# Altium schematic sheet sensor.SchDoc
size A3; SheetNumber: 1; SheetTotal: 2
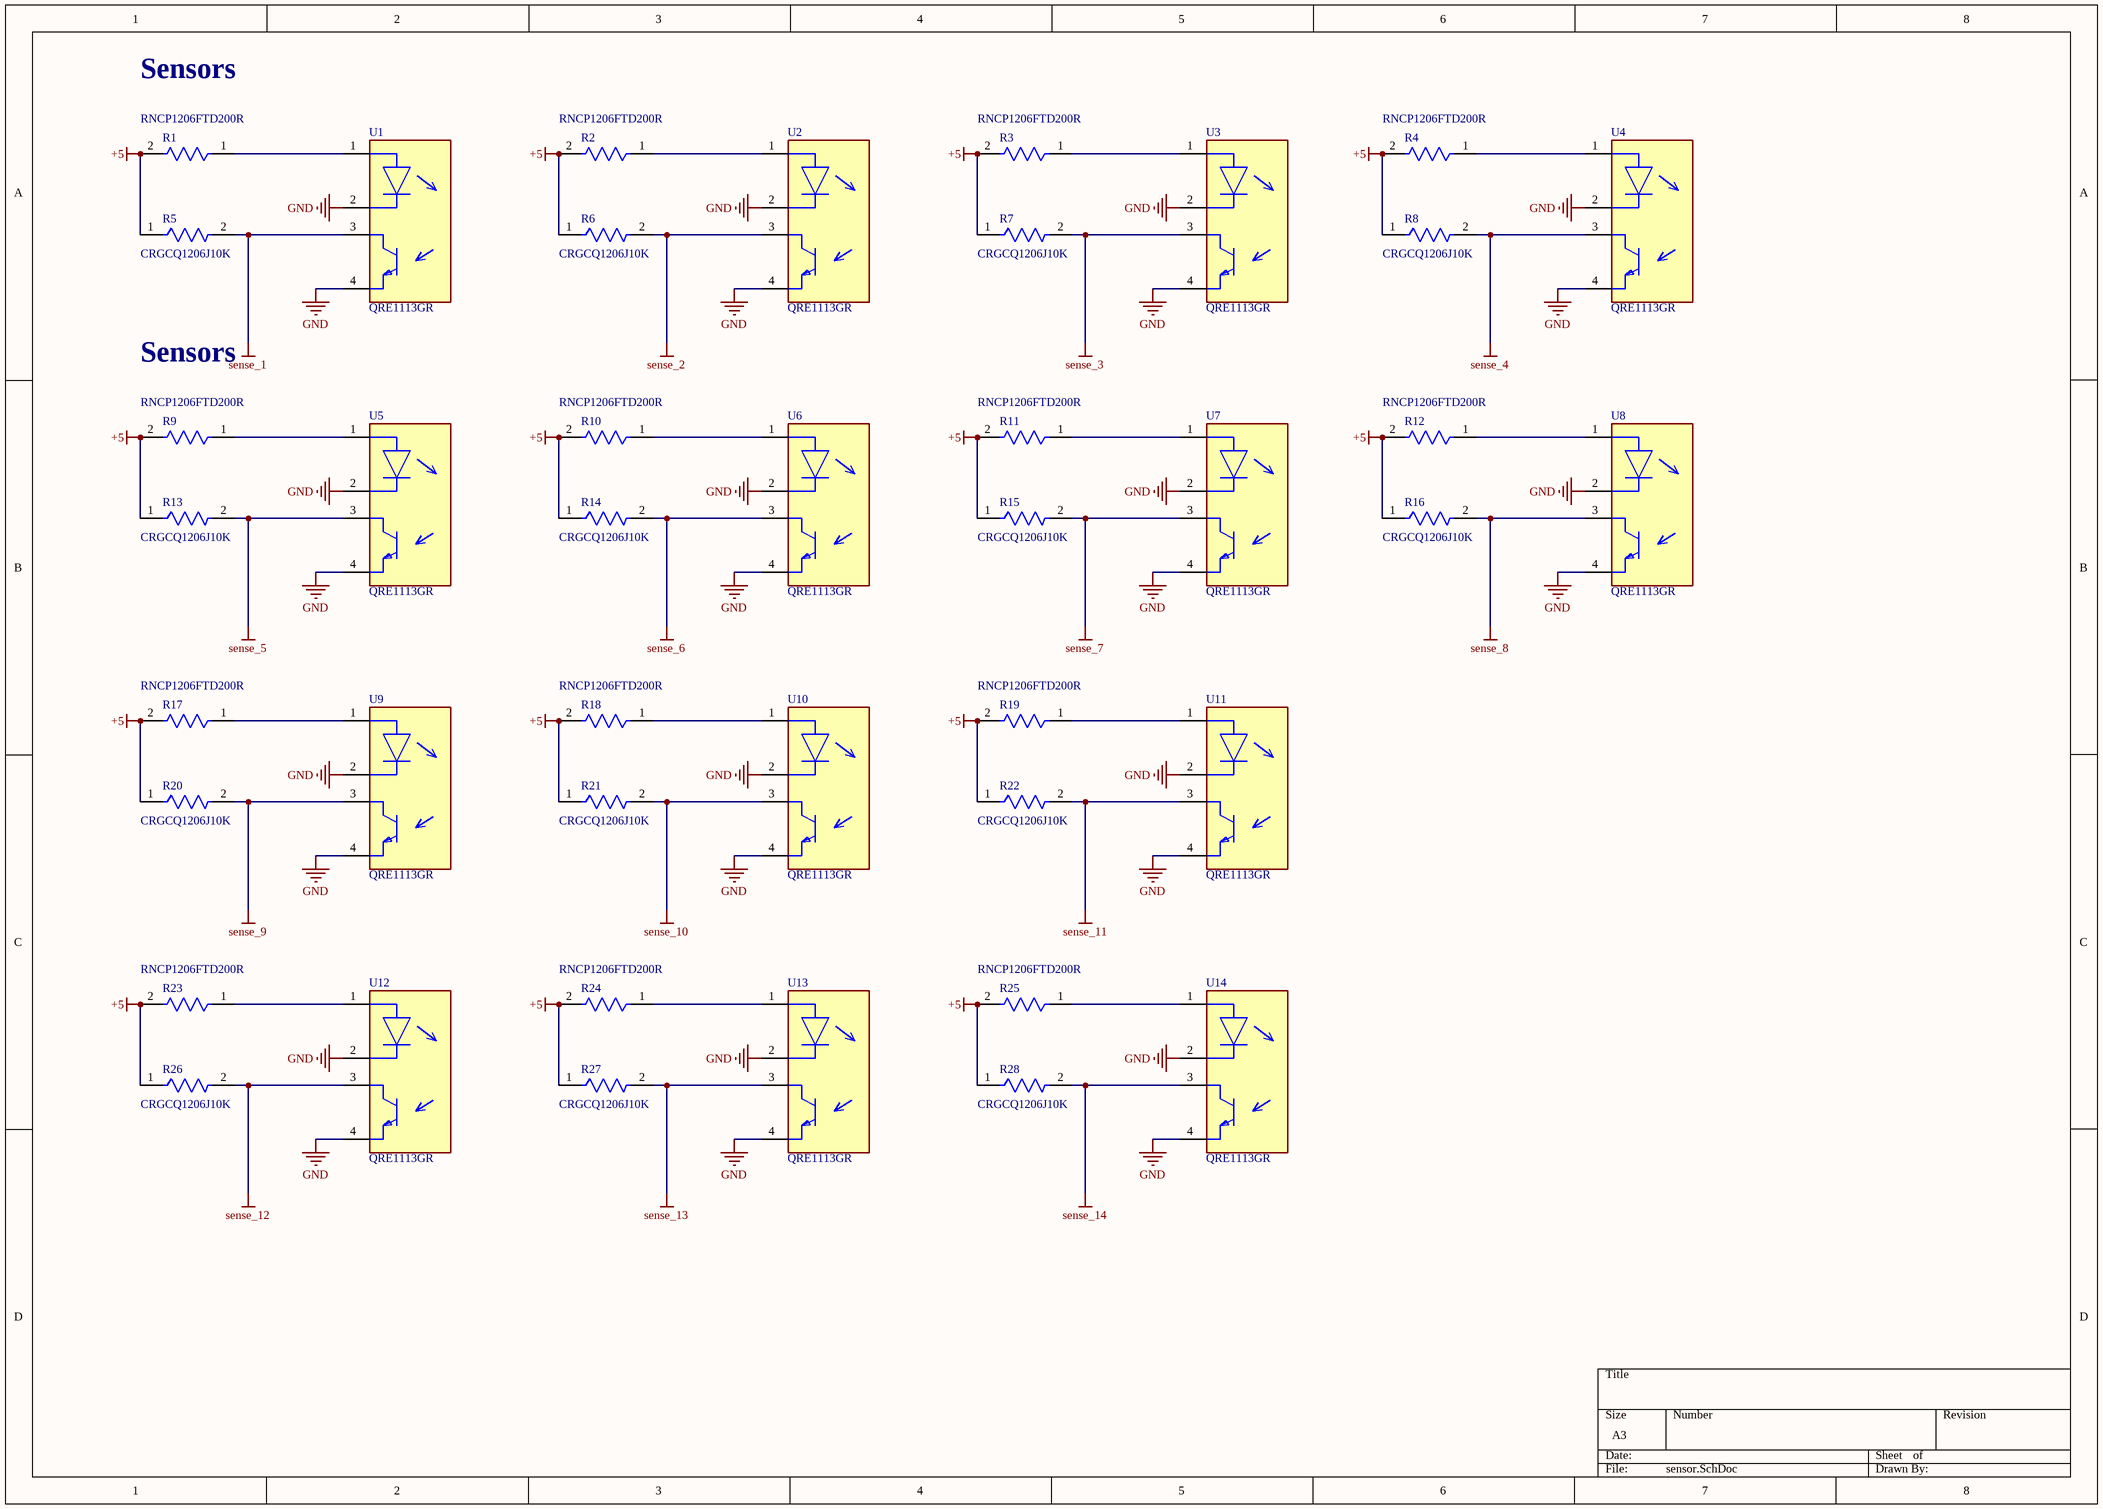
[diagram p0: sensor.SchDoc]

## Parts
R1  RNCP1206FTD200R  [FP-RNCP1206-IPC_B]
R2  RNCP1206FTD200R  [FP-RNCP1206-IPC_B]
R3  RNCP1206FTD200R  [FP-RNCP1206-IPC_B]
R4  RNCP1206FTD200R  [FP-RNCP1206-IPC_B]
R5  CRGCQ1206J10K  [FP-CRGCQ1206-IPC_C]
R6  CRGCQ1206J10K  [FP-CRGCQ1206-IPC_C]
R7  CRGCQ1206J10K  [FP-CRGCQ1206-IPC_C]
R8  CRGCQ1206J10K  [FP-CRGCQ1206-IPC_C]
R9  RNCP1206FTD200R  [FP-RNCP1206-IPC_B]
R10  RNCP1206FTD200R  [FP-RNCP1206-IPC_B]
R11  RNCP1206FTD200R  [FP-RNCP1206-IPC_B]
R12  RNCP1206FTD200R  [FP-RNCP1206-IPC_B]
R13  CRGCQ1206J10K  [FP-CRGCQ1206-IPC_C]
R14  CRGCQ1206J10K  [FP-CRGCQ1206-IPC_C]
R15  CRGCQ1206J10K  [FP-CRGCQ1206-IPC_C]
R16  CRGCQ1206J10K  [FP-CRGCQ1206-IPC_C]
R17  RNCP1206FTD200R  [FP-RNCP1206-IPC_B]
R18  RNCP1206FTD200R  [FP-RNCP1206-IPC_B]
R19  RNCP1206FTD200R  [FP-RNCP1206-IPC_B]
R20  CRGCQ1206J10K  [FP-CRGCQ1206-IPC_C]
R21  CRGCQ1206J10K  [FP-CRGCQ1206-IPC_C]
R22  CRGCQ1206J10K  [FP-CRGCQ1206-IPC_C]
R23  RNCP1206FTD200R  [FP-RNCP1206-IPC_B]
R24  RNCP1206FTD200R  [FP-RNCP1206-IPC_B]
R25  RNCP1206FTD200R  [FP-RNCP1206-IPC_B]
R26  CRGCQ1206J10K  [FP-CRGCQ1206-IPC_C]
R27  CRGCQ1206J10K  [FP-CRGCQ1206-IPC_C]
R28  CRGCQ1206J10K  [FP-CRGCQ1206-IPC_C]
U1  QRE1113GR  [FP-100CY-MFG]
U2  QRE1113GR  [FP-100CY-MFG]
U3  QRE1113GR  [FP-100CY-MFG]
U4  QRE1113GR  [FP-100CY-MFG]
U5  QRE1113GR  [FP-100CY-MFG]
U6  QRE1113GR  [FP-100CY-MFG]
U7  QRE1113GR  [FP-100CY-MFG]
U8  QRE1113GR  [FP-100CY-MFG]
U9  QRE1113GR  [FP-100CY-MFG]
U10  QRE1113GR  [FP-100CY-MFG]
U11  QRE1113GR  [FP-100CY-MFG]
U12  QRE1113GR  [FP-100CY-MFG]
U13  QRE1113GR  [FP-100CY-MFG]
U14  QRE1113GR  [FP-100CY-MFG]

## Nets
+5: R1.2 R2.2 R3.2 R4.2 R5.1 R6.1 R7.1 R8.1 R9.2 R10.2 R11.2 R12.2 R13.1 R14.1 R15.1 R16.1 R17.2 R18.2 R19.2 R20.1 R21.1 R22.1 R23.2 R24.2 R25.2 R26.1 R27.1 R28.1
GND: U1.2(C) U1.4(E) U2.2(C) U2.4(E) U3.2(C) U3.4(E) U4.2(C) U4.4(E) U5.2(C) U5.4(E) U6.2(C) U6.4(E) U7.2(C) U7.4(E) U8.2(C) U8.4(E) U9.2(C) U9.4(E) U10.2(C) U10.4(E) U11.2(C) U11.4(E) U12.2(C) U12.4(E) U13.2(C) U13.4(E) U14.2(C) U14.4(E)
sense_1: R5.2 U1.3(C)
sense_2: R6.2 U2.3(C)
sense_3: R7.2 U3.3(C)
sense_4: R8.2 U4.3(C)
sense_5: R13.2 U5.3(C)
sense_6: R14.2 U6.3(C)
sense_7: R15.2 U7.3(C)
sense_8: R16.2 U8.3(C)
sense_9: R20.2 U9.3(C)
sense_10: R21.2 U10.3(C)
sense_11: R22.2 U11.3(C)
sense_12: R26.2 U12.3(C)
sense_13: R27.2 U13.3(C)
sense_14: R28.2 U14.3(C)
NetR1_1: R1.1 U1.1(A)
NetR2_1: R2.1 U2.1(A)
NetR3_1: R3.1 U3.1(A)
NetR4_1: R4.1 U4.1(A)
NetR9_1: R9.1 U5.1(A)
NetR10_1: R10.1 U6.1(A)
NetR11_1: R11.1 U7.1(A)
NetR12_1: R12.1 U8.1(A)
NetR17_1: R17.1 U9.1(A)
NetR18_1: R18.1 U10.1(A)
NetR19_1: R19.1 U11.1(A)
NetR23_1: R23.1 U12.1(A)
NetR24_1: R24.1 U13.1(A)
NetR25_1: R25.1 U14.1(A)

## Notes on the sheet
- Sensors

## Library data of the parts
R1-R4 R9-R12 R17-R19 R23-R25 = CMP-26527-001516-1: 200Ω ±1% 0.5W 1206 High Power Anti-Sulfur Thin Film Chip Resistor; Temperature Coefficient: 100ppm/°C; Resistance: 200R; Max Power Dissipation: 500mW; Series: RNCP; Max Operating Temperature: 155°C; Min Operating Temperature: -55°C; Mount: Surface Mount; RoHS Compliant: Yes; Tolerance: 1%; Height: 0.024inch; Resistor Type: Thin Film; Packaging: Tape and Reel; Case Code (Imperial): 1206; Case/Package: 1206; Lead Free: Lead Free; Width: 0.059inch; Number of Terminations: 2; Case Code (Metric): 3216; Length: 0.122inch; Features: Moisture Resistant
R5-R8 R13-R16 R20-R22 R26-R28 = CMP-03211-002305-1: CRGCQ1206 10KΩ 0.25W 5% ±100ppm/°C 200V; Manufacturer: TE Connectivity; Automotive Grade: Grade 914; Tolerance: 0.05; Package: CRGCQ1206; Composition: Thick Film; Lead Free: Yes; Device Class L1: Passive Components; RoHS: TRUE; Temperature: -55°C to +155°C; Series: CRGCQ; Temperature Range Low: -55°C; Ipc Land Pattern Name: RESC310155X55; Value: 10KΩ; Resistance: 10KΩ; Manufacturer Part Number: CRGCQ1206J10K; Voltage Rating: 200V; Temperature Range High: +155°C; Temperature Coefficient: ±100ppm/°C; Device Class L3: Chip SMD Resistors; ComponentLink2Description: Datasheet; ComponentLink2URL: https://www.te.com/commerce/DocumentDelivery/DDEController?Action=showdoc&DocId=Data+Sheet%7F1773204-3%7F1%7Fpdf%7FEnglish%7FENG_DS_1773204-3_1.pdf%7F4-2176347-923; Device Class L2: Resistors; Ambient Temperature Range High: +70°C; Automotive: Yes; Octopart: https://octopart.com/crgcq1206j10k-te+connectivity-91018305; Category: Res; Height: 0.65mm; Power Rating: 0.25W
U1-U14 = CMP-2000-06919-2: SENSOR OPTO TRANS REFL SMD PHOTO; Wavelength: 940nm; Fall Time: 20us; Forward Current: 50mA; Max Power Dissipation: 75mW; Operating Supply Voltage: 1.7V; Reverse Voltage (DC): 5V; Max Breakdown Voltage: 30V; Forward Voltage: 1.2V; Output Type: Phototransistor; Number of Elements: 1; Sensing Distance: 0.197inch; Max Collector Current: 20mA; Contact Plating: Tin; Packaging: Tape and Reel; Rise Time: 20us; Response Time: 20us; Case/Package: SMD/SMT; REACH SVHC: No SVHC; Lead Free: Lead Free; Width: 2.9mm; Package Quantity: 1000; Mount: Surface Mount; Input Current: 50mA; Max Operating Temperature: 85°C; Weight: 0.078g; Power Dissipation: 75mW; Reverse Breakdown Voltage: 5V; Collector Emitter Voltage (VCEO): 30V; Collector Emitter Breakdown Voltage: 30V; Number of Pins: 4; Min Operating Temperature: -40°C; Radiation Hardening: No; Height: 1.7mm; Number of Channels: 1; Length: 3.6mm